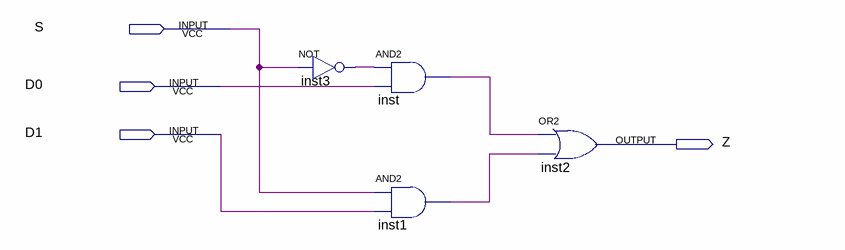
[diagram p0: schematic sheet]
// Quartus schematic mux2.bdf as structural Verilog: 4 symbols, 4 pins
module mux2 (
  input  S,
  input  D0,
  input  D1,
  output Z
);

  wire inst1_out, inst3_out, inst_out;

  not inst3 (inst3_out, S);
  and inst (inst_out, inst3_out, D0);
  and inst1 (inst1_out, S, D1);
  or inst2 (Z, inst_out, inst1_out);
endmodule
